# Altium schematic sheet GPS.SchDoc
size A; SheetNumber: 5; SheetTotal: 6
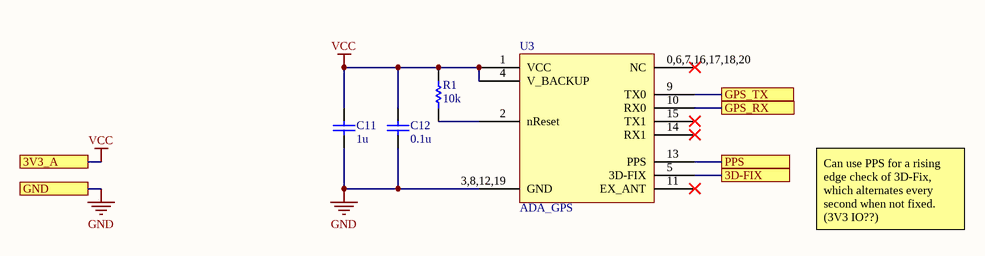
[diagram p0: GPS.SchDoc]

## Parts
C11  value 1u  (hidden comment: Capacitor)
C12  value 0.1u  (hidden comment: Capacitor)
R1  value 10k  (hidden comment: Resistor)
U3  ADA_GPS  [PA1616D]

## Ports
3D-FIX, 3V3_A, GND, GPS_RX, GPS_TX, PPS

## Nets
GND: C11.1 C12.1 U3.3,8,12,19(GND) ; port GND
VCC: C11.2 C12.2 R1.2 U3.1(VCC) U3.4(V_BACKUP) ; port 3V3_A
3D-FIX: U3.5(3D-FIX) ; port 3D-FIX
GPS_RX: U3.10(RX0) ; port GPS_RX
GPS_TX: U3.9(TX0) ; port GPS_TX
PPS: U3.13(PPS) ; port PPS
NetR1_1: R1.1 U3.2(nReset)

Not connected (* = marked no-connect by the designer): U3 0,6,7,16,17,18,20(NC)* 11(EX_ANT)* 14(RX1)* 15(TX1)*

## Notes on the sheet
- Can use PPS for a rising edge check of 3D-Fix, which alternates every second when not fixed. (3V3 IO??)

## Library data of the parts
C11 C12 = Capacitor: SimulationGenericComponent: True
R1 = Resistor: TC1: 0; SimulationGenericComponent: True; TC2: 0